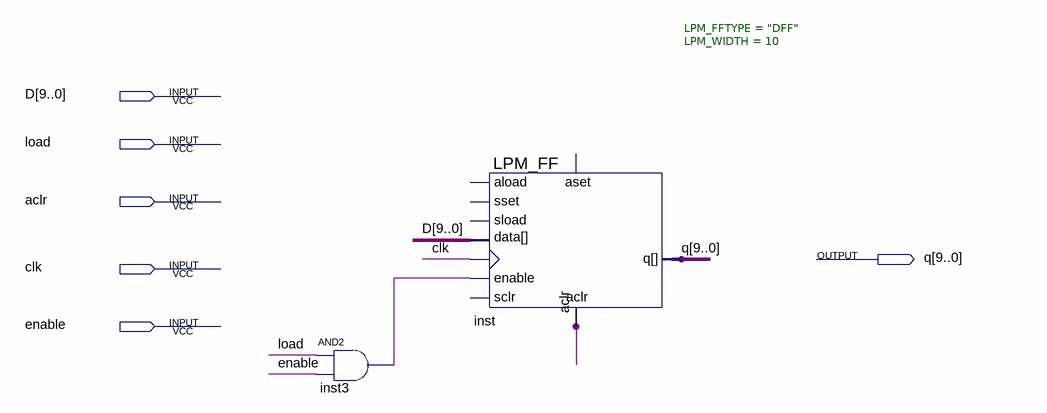
[diagram p0: schematic sheet]
// Quartus schematic cr.bdf as structural Verilog: 2 symbols, 6 pins
module cr (
  input  [9:0] D,
  input  load,
  input  aclr,
  input  clk,
  input  enable,
  output [9:0] q
);

  wire inst3_out;

  and inst3 (inst3_out, load, enable);
  LPM_FF #(.LPM_FFTYPE("DFF"), .LPM_WIDTH(10)) inst (
    .enable(inst3_out), .clock(clk), .aclr(aclr), .data(D), .q(q));  // open: aload, sset, sload, aset, sclr
endmodule
